# EAGLE schematic Glove (EAGLE 9.2.0)

## Sheet 1 of 4: MCU Pinout
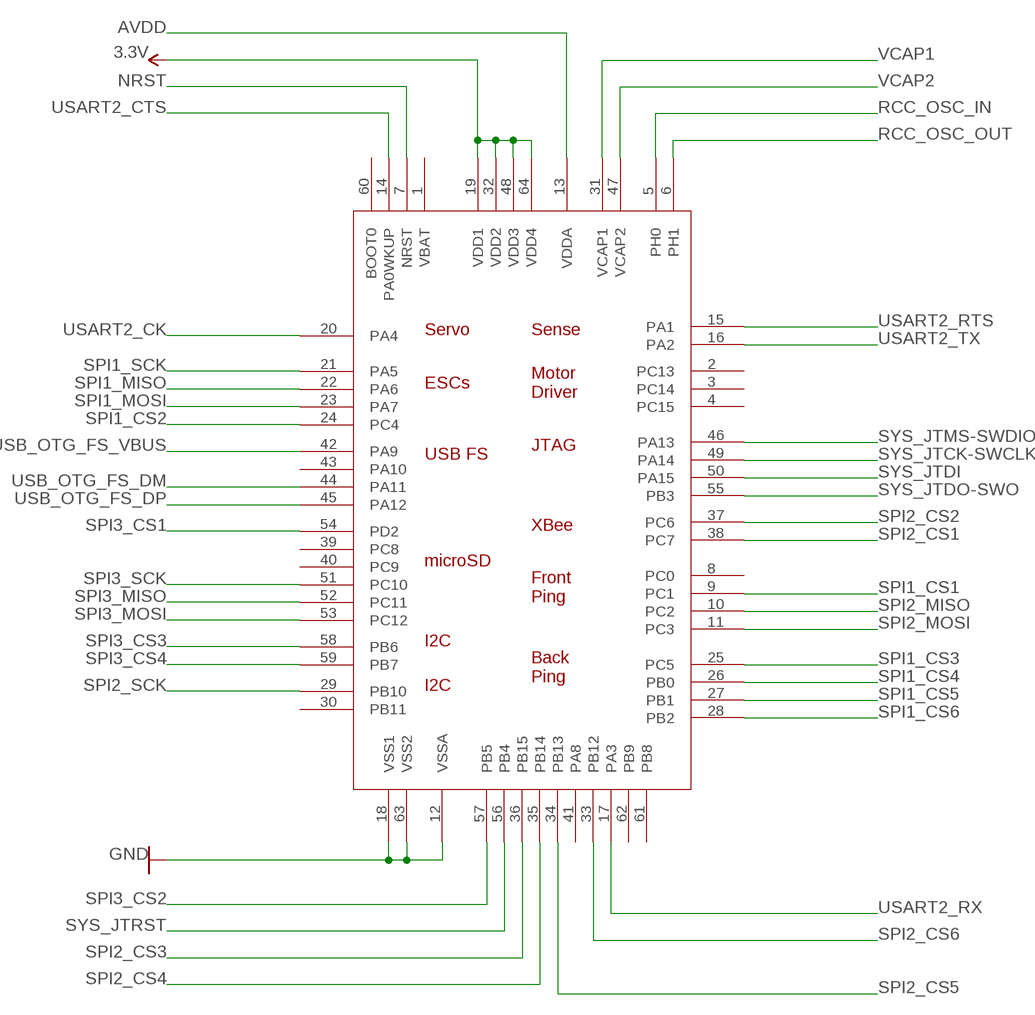
[diagram p0: schematic, sheet 1]

### Parts
U$1  STM32F4R_64PIN_FOXCAR  [LQFP64]

### Nets
3.3V: U$1.19(VDD1) U$1.32(VDD2) U$1.48(VDD3) U$1.64(VDD4) ; also sheet 4
AVDD: U$1.13(VDDA) ; also sheet 4
GND: U$1.12(VSSA) U$1.18(VSS1) U$1.63(VSS2) ; also sheet 3,4
NRST: U$1.7(NRST) ; also sheet 4
RCC_OSC_IN: U$1.5(PH0) ; also sheet 4
RCC_OSC_OUT: U$1.6(PH1) ; also sheet 4
SPI1_CS1: U$1.9(PC1)
SPI1_CS2: U$1.24(PC4)
SPI1_CS3: U$1.25(PC5)
SPI1_CS4: U$1.26(PB0)
SPI1_CS5: U$1.27(PB1)
SPI1_CS6: U$1.28(PB2)
SPI1_MISO: U$1.22(PA6)
SPI1_MOSI: U$1.23(PA7)
SPI1_SCK: U$1.21(PA5)
SPI2_CS1: U$1.38(PC7)
SPI2_CS2: U$1.37(PC6)
SPI2_CS3: U$1.36(PB15)
SPI2_CS4: U$1.35(PB14)
SPI2_CS5: U$1.34(PB13)
SPI2_CS6: U$1.33(PB12)
SPI2_MISO: U$1.10(PC2)
SPI2_MOSI: U$1.11(PC3)
SPI2_SCK: U$1.29(PB10)
SPI3_CS1: U$1.54(PD2)
SPI3_CS2: U$1.57(PB5)
SPI3_CS3: U$1.58(PB6)
SPI3_CS4: U$1.59(PB7)
SPI3_MISO: U$1.52(PC11)
SPI3_MOSI: U$1.53(PC12)
SPI3_SCK: U$1.51(PC10)
SYS_JTCK-SWCLK: U$1.49(PA14)
SYS_JTDI: U$1.50(PA15)
SYS_JTDO-SWO: U$1.55(PB3)
SYS_JTMS-SWDIO: U$1.46(PA13)
SYS_JTRST: U$1.56(PB4)
USART2_CK: U$1.20(PA4)
USART2_CTS: U$1.14(PA0WKUP)
USART2_RTS: U$1.15(PA1)
USART2_RX: U$1.17(PA3)
USART2_TX: U$1.16(PA2)
USB_OTG_FS_DM: U$1.44(PA11) ; also sheet 3
USB_OTG_FS_DP: U$1.45(PA12) ; also sheet 3
USB_OTG_FS_VBUS: U$1.42(PA9)
VCAP1: U$1.31(VCAP1) ; also sheet 4
VCAP2: U$1.47(VCAP2) ; also sheet 4
Unconnected: U$1.1(VBAT) U$1.2(PC13) U$1.3(PC14) U$1.4(PC15) U$1.8(PC0) U$1.30(PB11) U$1.39(PC8) U$1.40(PC9) U$1.41(PA8) U$1.43(PA10) U$1.60(BOOT0) U$1.61(PB8) U$1.62(PB9)

## Sheet 2 of 4: Accelerometers

## Sheet 3 of 4: USB, JTAG, USART
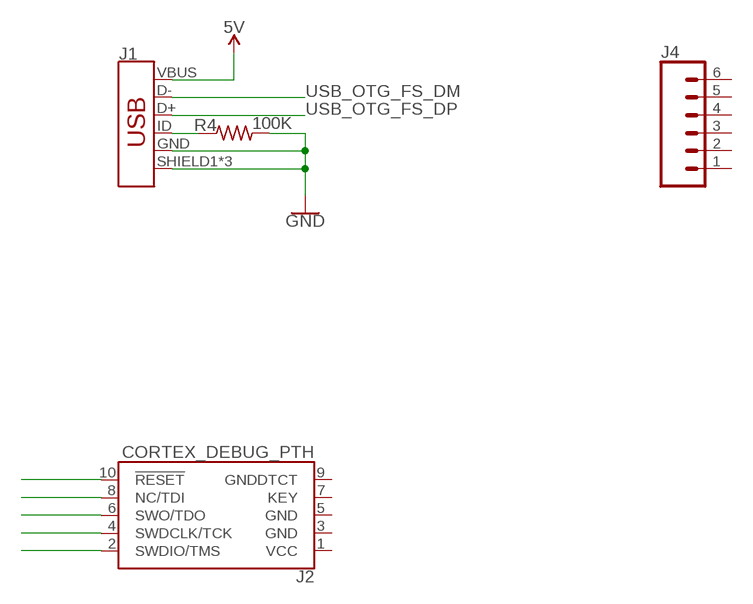
[diagram p1: schematic, sheet 3]

### Parts
J1  USB_MICRO-BREDUCED_PASTE  [USB-B-MICRO-SMD_RED_PASTE]
J2  CORTEX_DEBUG_PTH  [2X5-PTH-1.27MM]
J4  CONN_06SILK_FEMALE_PTH  [1X06]
R4  100K  R-US_R0805  [R0805]

### Nets
5V: J1.VBUS
GND: J1.GND J1.SHIELD1(SHIELD) J1.SHIELD2(SHIELD) J1.SHIELD3(SHIELD) R4.2 ; also sheet 1,4
N$4: J2.10(!RESET)
N$5: J1.ID R4.1
USB_OTG_FS_DM: J1.D- ; also sheet 1
USB_OTG_FS_DP: J1.D+ ; also sheet 1
Unconnected: J2.1(VCC) J2.2(SWDIO/TMS) J2.3(GND) J2.4(SWDCLK/TCK) J2.5(GND) J2.6(SWO/TDO) J2.7(KEY) J2.8(NC/TDI) J2.9(GNDDTCT) J4.1 J4.2 J4.3 J4.4 J4.5 J4.6

## Sheet 4 of 4: Power and Essentials
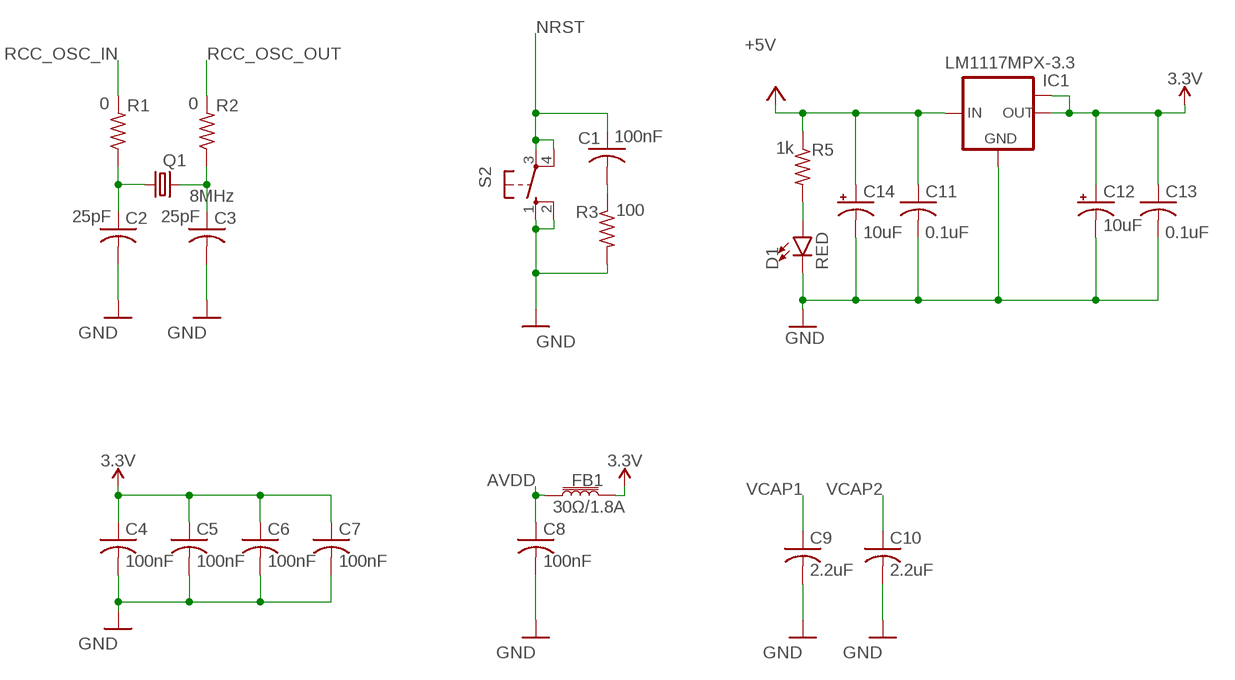
[diagram p2: schematic, sheet 4]

### Parts
C1  100nF  C-USC0805K  [C0805K]
C2  25pF  C-USC0805K  [C0805K]
C3  25pF  C-USC0805K  [C0805K]
C4  100nF  C-USC0805K  [C0805K]
C5  100nF  C-USC0805K  [C0805K]
C6  100nF  C-USC0805K  [C0805K]
C7  100nF  C-USC0805K  [C0805K]
C8  100nF  C-USC0805K  [C0805K]
C9  2.2uF  C-USC0805K  [C0805K]
C10  2.2uF  C-USC0805K  [C0805K]
C11  0.1uF  C-USC0805K  [C0805K]
C12  10uF  CPOL-USSMCD  [SMC_D]
C13  0.1uF  C-USC0805K  [C0805K]
C14  10uF  CPOL-USSMCD  [SMC_D]
D1  RED  LED-RED1206  [LED-1206]
FB1  30Ω/1.8A  FERRITE_BEAD-0603  [0603]
IC1  LM1117MPX-3.3  [SOT223]
Q1  8MHz  CRYSTAL-8MHZSMD-5X3.2  [CRYSTAL-SMD-5X3.2-4PAD]
R1  0  R-US_R0805  [R0805]
R2  0  R-US_R0805  [R0805]
R3  100  R-US_R0805  [R0805]
R5  1k  R-US_R0805  [R0805]
S2  10-XX  [B3F-10XX]

### Nets
3.3V: C4.1 C5.1 C6.1 C7.1 C12.+ C13.1 FB1.2 IC1.2(OUT) IC1.TAB(OUT1) ; also sheet 1
+5V: C11.1 C14.+ IC1.3(IN) R5.1
AVDD: C8.1 FB1.1 ; also sheet 1
GND: C2.2 C3.2 C4.2 C5.2 C6.2 C7.2 C8.2 C9.2 C10.2 C11.2 C12.- C13.2 C14.- D1.C IC1.1(GND) R3.2 S2.1(S) S2.2(S1) ; also sheet 1,3
N$1: C1.2 R3.1
N$2: C2.1 Q1.1 R1.1
N$3: C3.1 Q1.3 R2.1
N$6: D1.A R5.2
NRST: C1.1 S2.3(P) S2.4(P1) ; also sheet 1
RCC_OSC_IN: R1.2 ; also sheet 1
RCC_OSC_OUT: R2.2 ; also sheet 1
VCAP1: C9.1 ; also sheet 1
VCAP2: C10.1 ; also sheet 1

## Library data of the parts
C1-C11 C13 = rcl:C-US: CAPACITOR, American symbol; SPICEPREFIX: C
C12 C14 = rcl:CPOL-US: POLARIZED CAPACITOR, American symbol; SPICEPREFIX: C
D1 = SparkFun-LED:LED-RED: Red SMD LED Used in manufacturing of most products at SparkFun Packages: 0603 - SMD 0603 package [Product Link] <http://docs.avagotech.com/docs/AV02-0551EN> 0603 SMART - SMD 0603 SMART package ( more efficient and expensive)[Product Link] <http://www.osram-os.com/Graphics/XPic2/00077099_0.pdf> 1206 - SMD1206 package [Product Link] <https://www.sparkfun.com/datasheets/DevTools/LilyPad/Q150OVS4.pdff> SparkFun Products: Pro Mini 328 -5V <https://www.sparkfun.com/products/821> RedBoard <https://www.sparkfun.com/products/12757> IOIO-OTG <https://www.sparkfun.com/products/13613>; PROD_ID: DIO-09912
FB1 = SparkFun-Coils:FERRITE_BEAD: Ferrite Bead (blocks, cores, rings, chokes, etc.) Inductor with layers of ferrite used to suppress high frequencies. Often used to isolate high frequency noise. SparkFun Products: IOIO-OTG - V2.2 <https://www.sparkfun.com/products/13613> SparkFun SAMD21 Mini Breakout <https://www.sparkfun.com/products/13664> SparkFun 6 Degrees of Freedom Breakout - LSM6DS3 <https://www.sparkfun.com/products/13339> SparkFun SAMD21 Dev Breakout <https://www.sparkfun.com/products/13672>; PROD_ID: NDUC-13805
IC1 = lm1117:LM1117MPX-*
J1 = SparkFun-Connectors:USB_MICRO-B: USB Type Micro-B Connector Male/female and PTH/SMT variants SparkFun Products: SparkFun microB USB Breakout <https://www.sparkfun.com/products/12035> SparkFun USB microB Plug Breakout <https://www.sparkfun.com/products/10031> SparkFun ESP8266 Thing <https://www.sparkfun.com/products/13231>; PROD_ID: CONN-11752
J2 = SparkFun-Connectors:CORTEX_DEBUG: Cortex Debug Connector - 10 pin Supports JTAG debug, Serial Wire debug, and Serial Wire Viewer. PTH and SMD connector options available. General Connector Information <http://infocenter.arm.com/help/topic/com.arm.doc.faqs/attached/13634/cortex_debug_connectors.pdf> Products: PTH Connector <http://www.digikey.com/product-detail/en/cnc-tech/3220-10-0100-00/1175-1627-ND/3883661> -via Digi-Key SparkFun PSoc <https://www.sparkfun.com/products/13229> SparkFun T <https://www.sparkfun.com/products/13810>
J4 = SparkFun-Connectors:CONN_06: Multi connection point. Often used as Generic Header-pin footprint for 0.1 inch spaced/style header connections On any of the 0.1 inch spaced packages, you can populate with these: Break Away Headers - Straight <https://www.sparkfun.com/products/116> (PRT-00116) Break Away Male Headers - Right Angle <https://www.sparkfun.com/products/553> (PRT-00553) Female Headers <https://www.sparkfun.com/products/115> (PRT-00115) Break Away Headers - Machine Pin <https://www.sparkfun.com/products/117> (PRT-00117) Break Away Female Headers - Swiss Machine Pin <https://www.sparkfun.com/products/743> (PRT-00743) Arduino Stackable Header - 6 Pin <https://www.sparkfun.com/products/9280> (PRT-09280) For SCREWTERMINALS and SPRING TERMINALS visit here: Screw Terimnals on SparkFun.com <https://www.sparkfun.com/search/results?term=Screw+Terminals> (5mm/3.5mm/2.54mm spacing) This device is also useful as a general connection point to wire up your design to another part of your project. Our various solder wires solder well into these plated through hole pads. Hook-Up Wire - Assortment (Stranded, 22 AWG) <https://www.sparkfun.com/products/11375> (PRT-11375) Hook-Up Wire - Assortment (Solid Core, 22 AWG) <https://www.sparkfun.com/products/11367> (PRT-11367) View the entire wire category on our website here <https://www.sparkfun.com/categories/141>; PROD_ID: CONN-08437
Q1 = SparkFun-Clocks:CRYSTAL-8MHZ: 8MHz Crystal Datasheet Example <http://www.futureelectronics.com/en/technologies/electromechanical/timing-devices/crystals/Pages/6008189-ABM3B-8.000MHZ-B2-T.aspx?IM=0> Frequency: 8MHz Frequency Tolerance: ±20ppm Load Capacitance: 18pF SparkFun Products: Pro Micro -3.3V/8MHz <https://www.sparkfun.com/products/12587> WAV Trigger <https://www.sparkfun.com/products/13660>; PROD_ID: XTAL-09431
R1 R2 R4 = rcl:R-US_: RESISTOR, American symbol; SPICEPREFIX: R
R3 R5 = rcl:R-US_: RESISTOR, American symbol; SPICEPREFIX: 100
S2 = switch-omron:10-XX: OMRON SWITCH; MPN: B3F-1000; OC_FARNELL: 176432; OC_NEWARK: 36M3542
U$1 = stm32f4:STM32F4R_64PIN_FOXCAR: 64-pin STM32F4 chip with symbol for Foxcar Control Board v1.